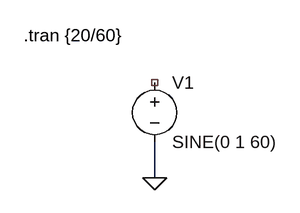
[diagram p0: schematic instrucciontran.asc]
instrucciontran.asc, the LTspice schematic file:
Version 4
SHEET 1 880 680
WIRE 64 224 64 176
FLAG 64 224 0
SYMBOL voltage 64 80 R0
WINDOW 123 0 0 Left 0
WINDOW 39 0 0 Left 0
SYMATTR InstName V1
SYMATTR Value SINE(0 1 60)
TEXT -112 32 Left 2 !.tran {20/60}

The netlist it stands for:
* instrucciontran.asc
V1 NC_01 0 SINE(0 1 60)
.tran {20/60}
.backanno
.end